# EAGLE schematic CyDAQ_schematic (EAGLE 9.0.1)
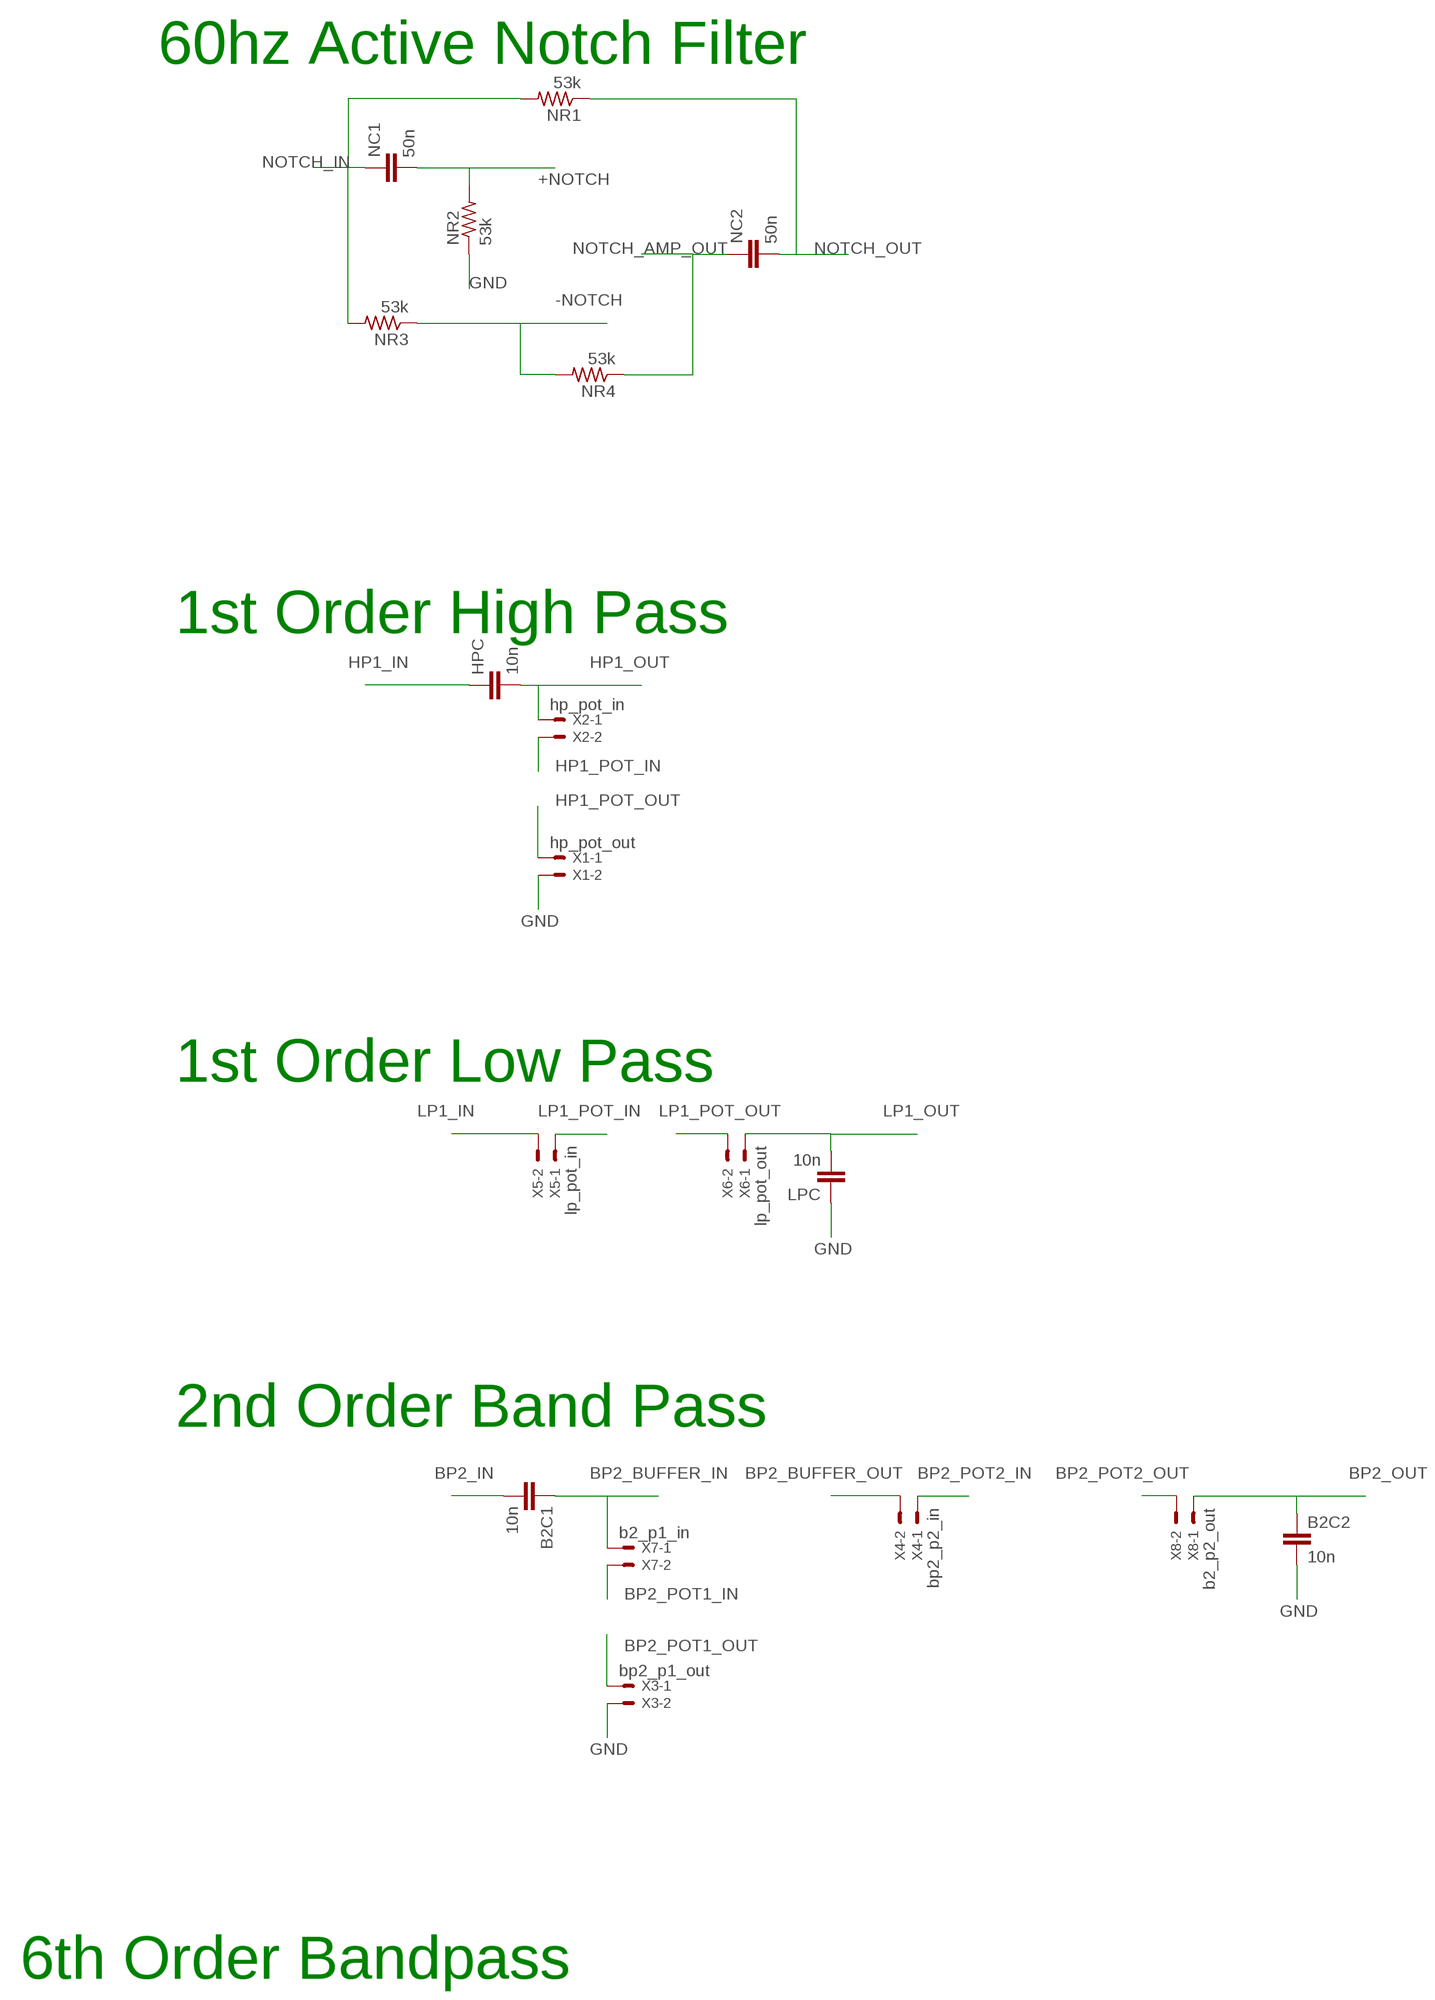
[diagram p0: schematic, sheet 1, part 1 of 3]
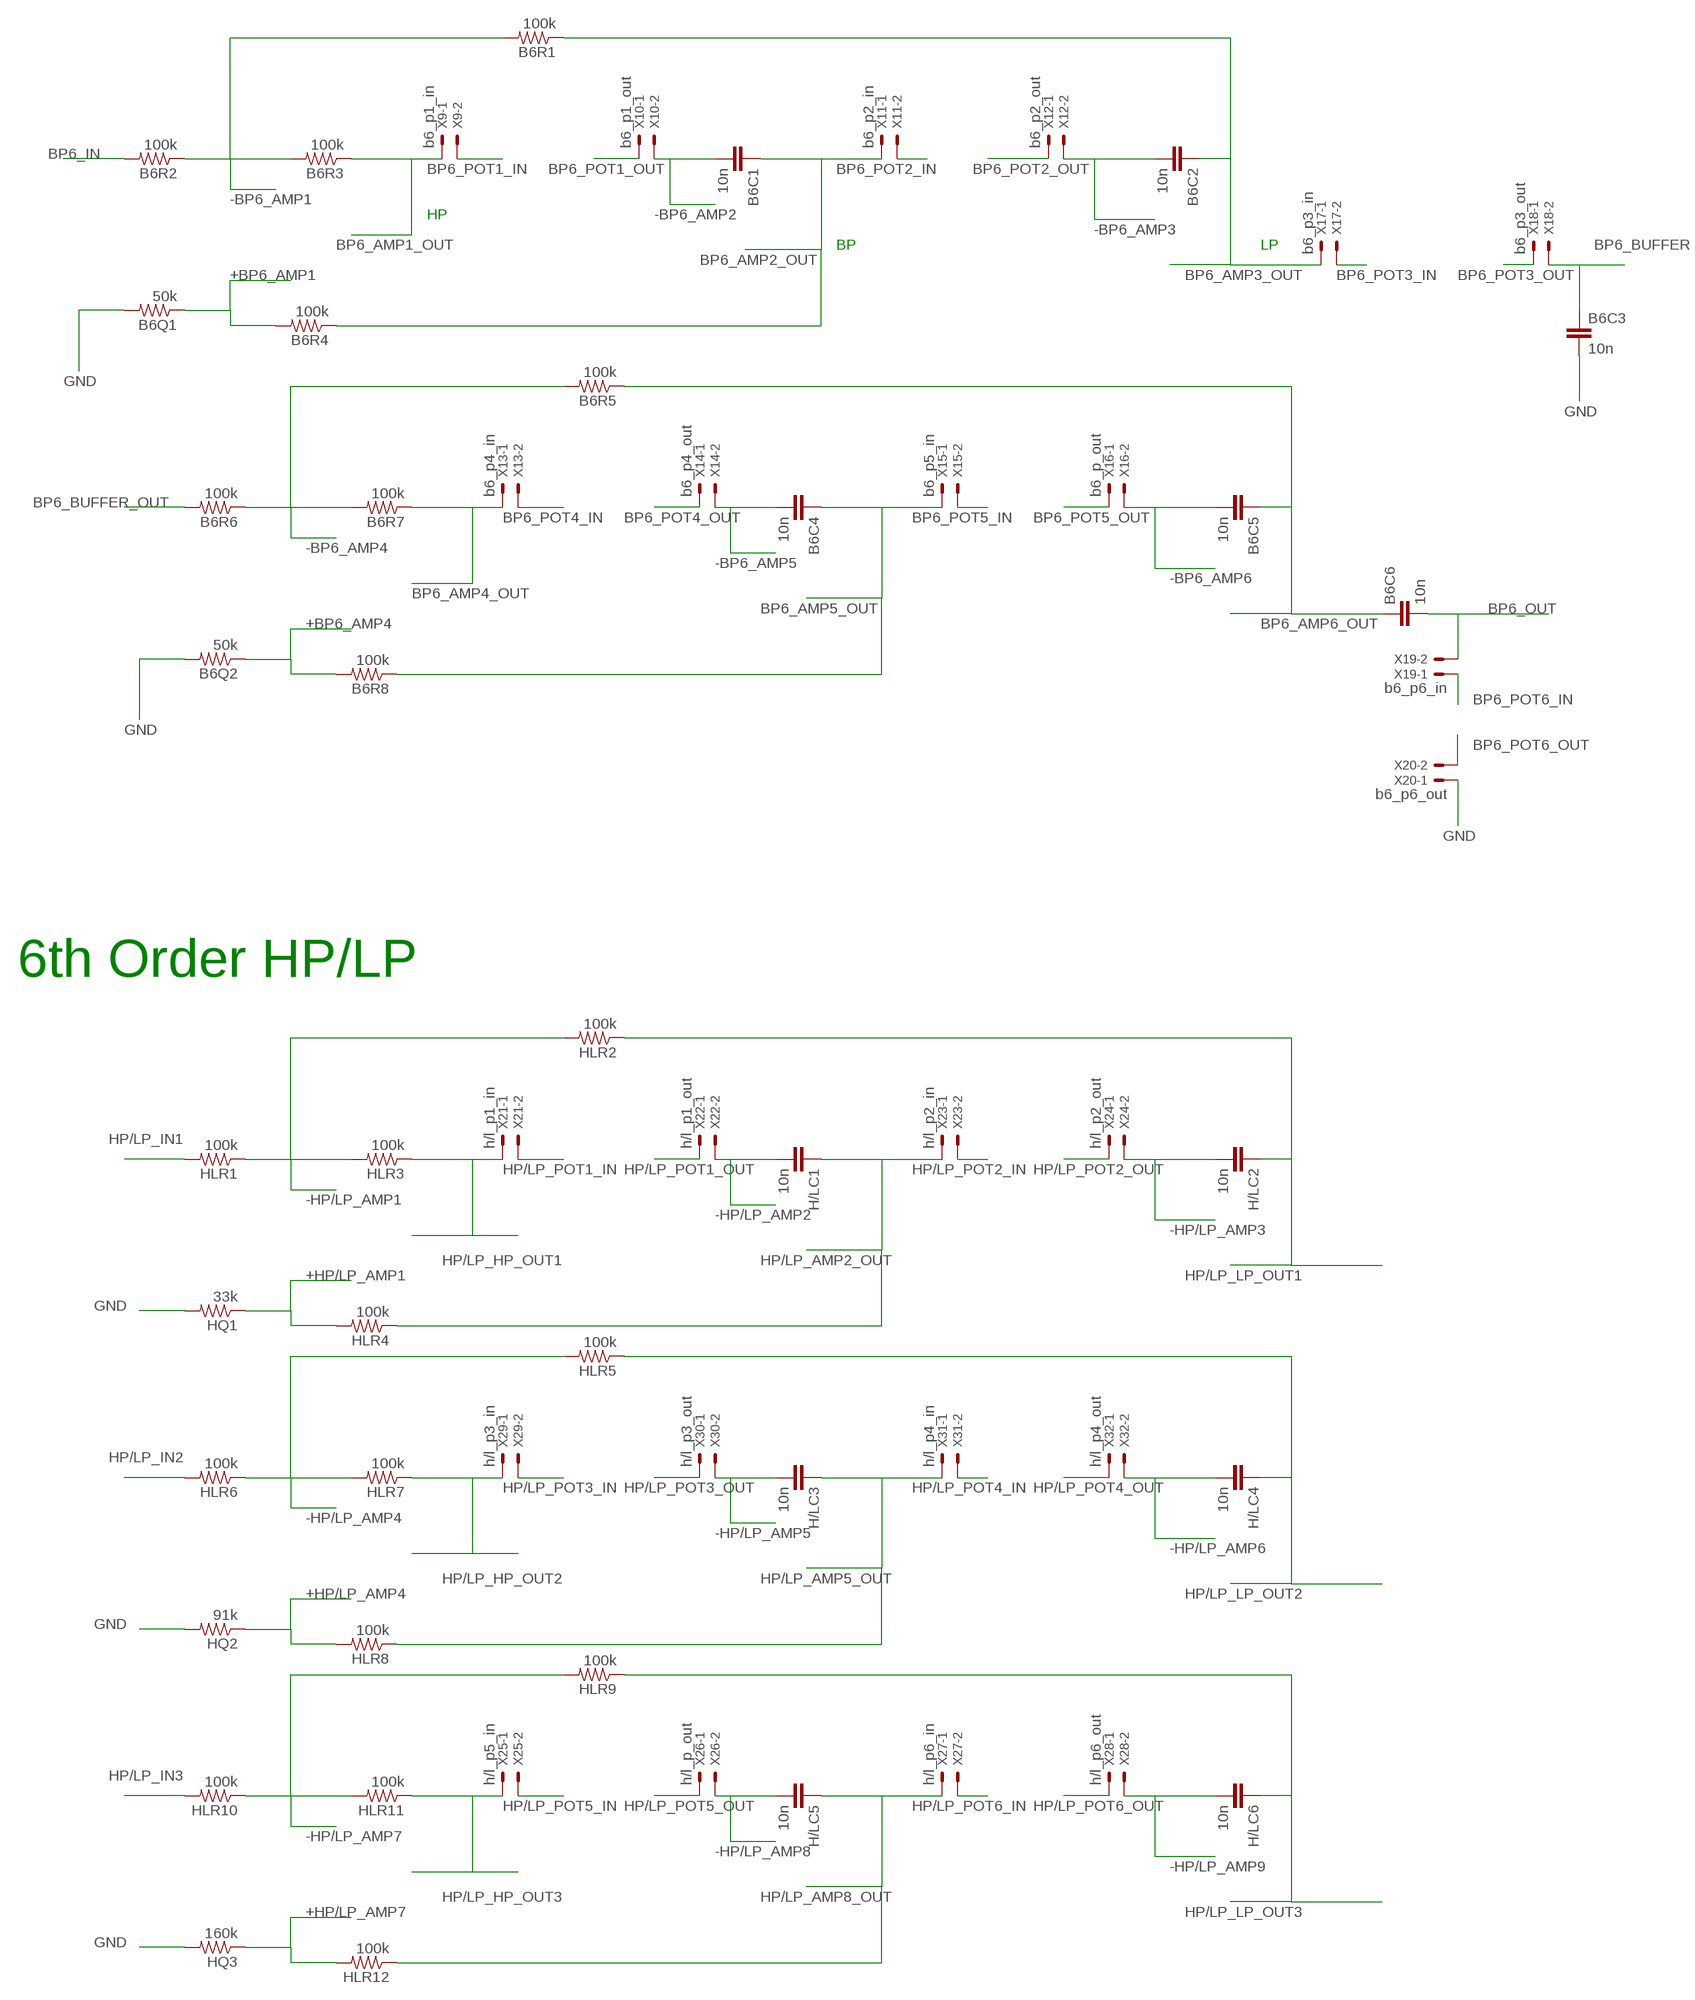
[diagram p1: schematic, sheet 1, part 2 of 3]
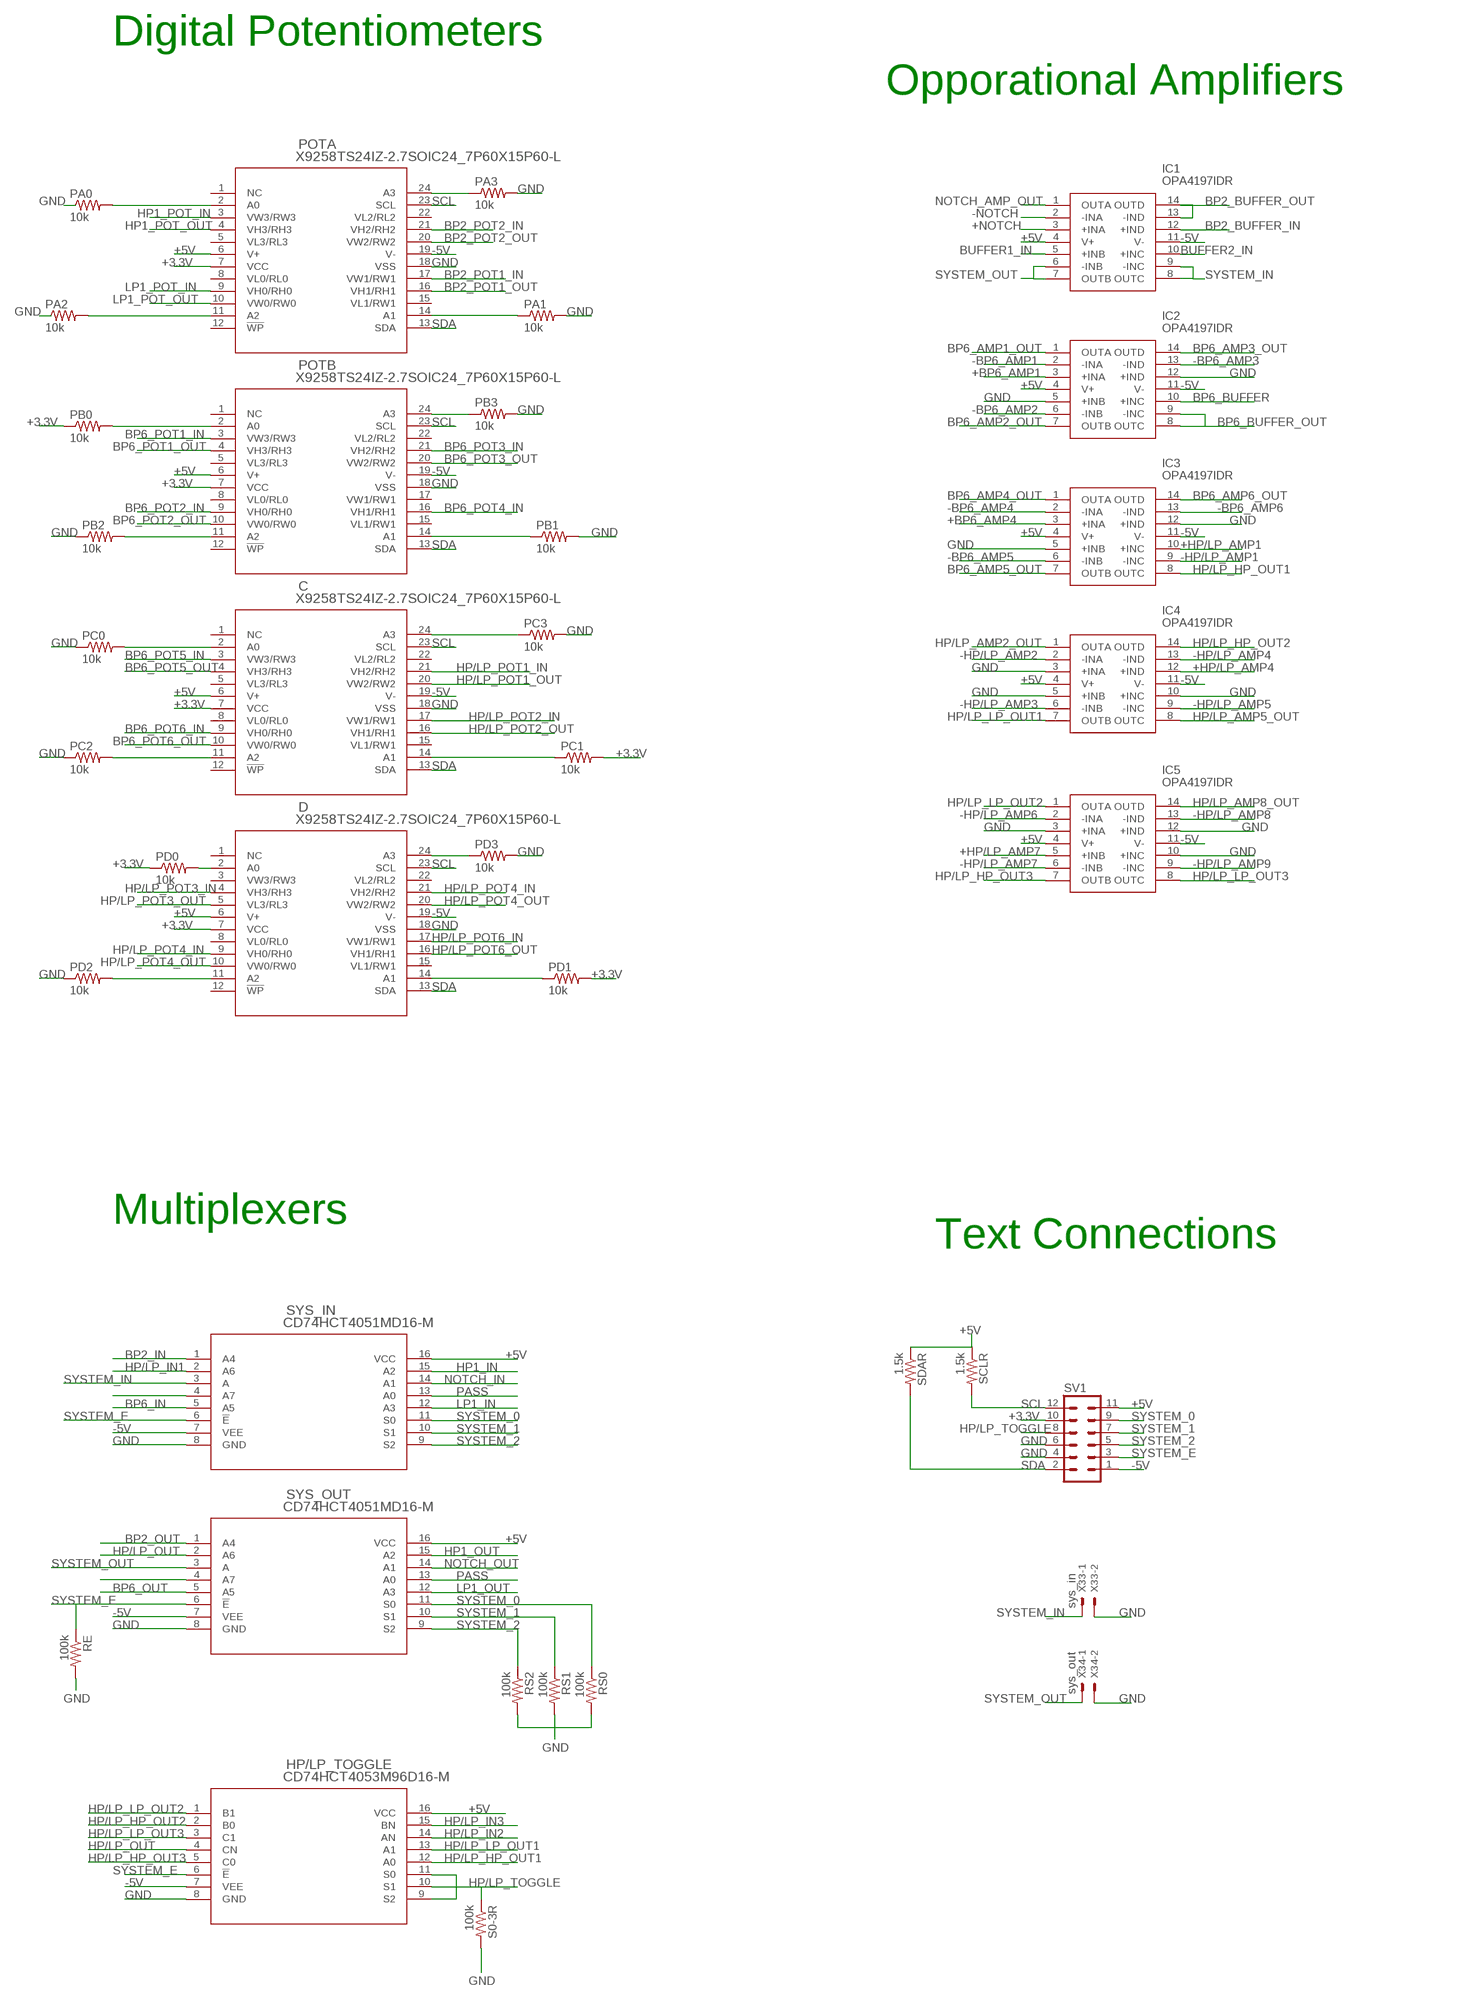
[diagram p2: schematic, sheet 1, part 3 of 3]

## Parts
B2C1  10n  C-EUC0805K  [C0805K]
B2C2  10n  C-EUC0805K  [C0805K]
B6C1  10n  C-EUC0805K  [C0805K]
B6C2  10n  C-EUC0805K  [C0805K]
B6C3  10n  C-EUC0805K  [C0805K]
B6C4  10n  C-EUC0805K  [C0805K]
B6C5  10n  C-EUC0805K  [C0805K]
B6C6  10n  C-EUC0805K  [C0805K]
B6Q1  50k  R-US_R0805W  [R0805W]
B6Q2  50k  R-US_R0805W  [R0805W]
B6R1  100k  R-US_R0805W  [R0805W]
B6R2  100k  R-US_R0805W  [R0805W]
B6R3  100k  R-US_R0805W  [R0805W]
B6R4  100k  R-US_R0805W  [R0805W]
B6R5  100k  R-US_R0805W  [R0805W]
B6R6  100k  R-US_R0805W  [R0805W]
B6R7  100k  R-US_R0805W  [R0805W]
B6R8  100k  R-US_R0805W  [R0805W]
C  X9258TS24IZ-2.7SOIC24_7P60X15P60-L  [SOIC24_7P60X15P60-L]
D  X9258TS24IZ-2.7SOIC24_7P60X15P60-L  [SOIC24_7P60X15P60-L]
H/LC1  10n  C-EUC0805K  [C0805K]
H/LC2  10n  C-EUC0805K  [C0805K]
H/LC3  10n  C-EUC0805K  [C0805K]
H/LC4  10n  C-EUC0805K  [C0805K]
H/LC5  10n  C-EUC0805K  [C0805K]
H/LC6  10n  C-EUC0805K  [C0805K]
HLR1  100k  R-US_R0805W  [R0805W]
HLR2  100k  R-US_R0805W  [R0805W]
HLR3  100k  R-US_R0805W  [R0805W]
HLR4  100k  R-US_R0805W  [R0805W]
HLR5  100k  R-US_R0805W  [R0805W]
HLR6  100k  R-US_R0805W  [R0805W]
HLR7  100k  R-US_R0805W  [R0805W]
HLR8  100k  R-US_R0805W  [R0805W]
HLR9  100k  R-US_R0805W  [R0805W]
HLR10  100k  R-US_R0805W  [R0805W]
HLR11  100k  R-US_R0805W  [R0805W]
HLR12  100k  R-US_R0805W  [R0805W]
HP/LP_TOGGLE  CD74HCT4053M96D16-M  [D16-M]
HPC  10n  C-EUC0805K  [C0805K]
HQ1  33k  R-US_R0805W  [R0805W]
HQ2  91k  R-US_R0805W  [R0805W]
HQ3  160k  R-US_R0805W  [R0805W]
IC1  OPA4197IDR  [SOIC127P600X175-14N]
IC2  OPA4197IDR  [SOIC127P600X175-14N]
IC3  OPA4197IDR  [SOIC127P600X175-14N]
IC4  OPA4197IDR  [SOIC127P600X175-14N]
IC5  OPA4197IDR  [SOIC127P600X175-14N]
LPC  10n  C-EUC0805K  [C0805K]
NC1  50n  C-EUC0805K  [C0805K]
NC2  50n  C-EUC0805K  [C0805K]
NR1  53k  R-US_R0805W  [R0805W]
NR2  53k  R-US_R0805W  [R0805W]
NR3  53k  R-US_R0805W  [R0805W]
NR4  53k  R-US_R0805W  [R0805W]
PA0  10k  R-US_R0805W  [R0805W]
PA1  10k  R-US_R0805W  [R0805W]
PA2  10k  R-US_R0805W  [R0805W]
PA3  10k  R-US_R0805W  [R0805W]
PB0  10k  R-US_R0805W  [R0805W]
PB1  10k  R-US_R0805W  [R0805W]
PB2  10k  R-US_R0805W  [R0805W]
PB3  10k  R-US_R0805W  [R0805W]
PC0  10k  R-US_R0805W  [R0805W]
PC1  10k  R-US_R0805W  [R0805W]
PC2  10k  R-US_R0805W  [R0805W]
PC3  10k  R-US_R0805W  [R0805W]
PD0  10k  R-US_R0805W  [R0805W]
PD1  10k  R-US_R0805W  [R0805W]
PD2  10k  R-US_R0805W  [R0805W]
PD3  10k  R-US_R0805W  [R0805W]
POTA  X9258TS24IZ-2.7SOIC24_7P60X15P60-L  [SOIC24_7P60X15P60-L]
POTB  X9258TS24IZ-2.7SOIC24_7P60X15P60-L  [SOIC24_7P60X15P60-L]
RE  100k  R-US_R0805W  [R0805W]
RS0  100k  R-US_R0805W  [R0805W]
RS1  100k  R-US_R0805W  [R0805W]
RS2  100k  R-US_R0805W  [R0805W]
S0-3R  100k  R-US_R0805W  [R0805W]
SCLR  1.5k  R-US_R0805W  [R0805W]
SDAR  1.5k  R-US_R0805W  [R0805W]
SV1  MA06-2  [MA06-2]
SYS_IN  CD74HCT4051MD16-M  [D16-M]
SYS_OUT  CD74HCT4051MD16-M  [D16-M]
X1  hp_pot_out  22-23-2021  [22-23-2021]
X2  hp_pot_in  22-23-2021  [22-23-2021]
X3  bp2_p1_out  22-23-2021  [22-23-2021]
X4  bp2_p2_in  22-23-2021  [22-23-2021]
X5  lp_pot_in  22-23-2021  [22-23-2021]
X6  lp_pot_out  22-23-2021  [22-23-2021]
X7  b2_p1_in  22-23-2021  [22-23-2021]
X8  b2_p2_out  22-23-2021  [22-23-2021]
X9  b6_p1_in  22-23-2021  [22-23-2021]
X10  b6_p1_out  22-23-2021  [22-23-2021]
X11  b6_p2_in  22-23-2021  [22-23-2021]
X12  b6_p2_out  22-23-2021  [22-23-2021]
X13  b6_p4_in  22-23-2021  [22-23-2021]
X14  b6_p4_out  22-23-2021  [22-23-2021]
X15  b6_p5_in  22-23-2021  [22-23-2021]
X16  b6_p_out  22-23-2021  [22-23-2021]
X17  b6_p3_in  22-23-2021  [22-23-2021]
X18  b6_p3_out  22-23-2021  [22-23-2021]
X19  b6_p6_in  22-23-2021  [22-23-2021]
X20  b6_p6_out  22-23-2021  [22-23-2021]
X21  h/l_p1_in  22-23-2021  [22-23-2021]
X22  h/l_p1_out  22-23-2021  [22-23-2021]
X23  h/l_p2_in  22-23-2021  [22-23-2021]
X24  h/l_p2_out  22-23-2021  [22-23-2021]
X25  h/l_p5_in  22-23-2021  [22-23-2021]
X26  h/l_p_out  22-23-2021  [22-23-2021]
X27  h/l_p6_in  22-23-2021  [22-23-2021]
X28  h/l_p6_out  22-23-2021  [22-23-2021]
X29  h/l_p3_in  22-23-2021  [22-23-2021]
X30  h/l_p3_out  22-23-2021  [22-23-2021]
X31  h/l_p4_in  22-23-2021  [22-23-2021]
X32  h/l_p4_out  22-23-2021  [22-23-2021]
X33  sys_in  22-23-2021  [22-23-2021]
X34  sys_out  22-23-2021  [22-23-2021]

## Nets
+3.3V: C.7(VCC) D.7(VCC) PB0.1 PC1.2 PD0.1 PD1.2 POTA.7(VCC) POTB.7(VCC) SV1.10
+5V: C.6(V+) D.6(V+) HP/LP_TOGGLE.16(VCC) IC1.4(V+) IC2.4(V+) IC3.4(V+) IC4.4(V+) IC5.4(V+) POTA.6(V+) POTB.6(V+) SCLR.1 SDAR.1 SV1.11 SYS_IN.16(VCC) SYS_OUT.16(VCC)
+BP6_AMP1: B6Q1.1 B6R4.2 IC2.3(+INA)
+BP6_AMP4: B6Q2.1 B6R8.2 IC3.3(+INA)
+HP/LP_AMP1: HLR4.2 HQ1.1 IC3.10(+INC)
+HP/LP_AMP4: HLR8.2 HQ2.1 IC4.12(+IND)
+HP/LP_AMP7: HLR12.2 HQ3.1 IC5.5(+INB)
+NOTCH: IC1.3(+INA) NC1.2 NR2.2
-5V: C.19(V-) D.19(V-) HP/LP_TOGGLE.7(VEE) IC1.11(V-) IC2.11(V-) IC3.11(V-) IC4.11(V-) IC5.11(V-) POTA.19(V-) POTB.19(V-) SV1.1 SYS_IN.7(VEE) SYS_OUT.7(VEE)
-BP6_AMP1: B6R1.2 B6R2.1 B6R3.2 IC2.2(-INA)
-BP6_AMP2: B6C1.2 IC2.6(-INB) X10.2
-BP6_AMP3: B6C2.2 IC2.13(-IND) X12.2
-BP6_AMP4: B6R5.2 B6R6.1 B6R7.2 IC3.2(-INA)
-BP6_AMP5: B6C4.2 IC3.6(-INB) X14.2
-BP6_AMP6: B6C5.2 IC3.13(-IND) X16.2
-HP/LP_AMP1: HLR1.1 HLR2.2 HLR3.2 IC3.9(-INC)
-HP/LP_AMP2: H/LC1.2 IC4.2(-INA) X22.2
-HP/LP_AMP3: H/LC2.2 IC4.6(-INB) X24.2
-HP/LP_AMP4: HLR5.2 HLR6.1 HLR7.2 IC4.13(-IND)
-HP/LP_AMP5: H/LC3.2 IC4.9(-INC) X30.2
-HP/LP_AMP6: H/LC4.2 IC5.2(-INA) X32.2
-HP/LP_AMP7: HLR9.2 HLR10.1 HLR11.2 IC5.6(-INB)
-HP/LP_AMP8: H/LC5.2 IC5.13(-IND) X26.2
-HP/LP_AMP9: H/LC6.2 IC5.9(-INC) X28.2
-NOTCH: IC1.2(-INA) NR3.1 NR4.2
BP2_BUFFER_IN: B2C1.1 IC1.12(+IND) X7.1
BP2_BUFFER_OUT: IC1.13(-IND) IC1.14(OUTD) X4.2
BP2_IN: B2C1.2 SYS_IN.1(A4)
BP2_OUT: B2C2.1 SYS_OUT.1(A4) X8.1
BP2_POT1_IN: POTA.17(VW1/RW1) X7.2
BP2_POT1_OUT: POTA.16(VH1/RH1) X3.1
BP2_POT2_IN: POTA.21(VH2/RH2) X4.1
BP2_POT2_OUT: POTA.20(VW2/RW2) X8.2
BP6_AMP1_OUT: B6R3.1 IC2.1(OUTA) X9.1
BP6_AMP2_OUT: B6C1.1 B6R4.1 IC2.7(OUTB) X11.1
BP6_AMP3_OUT: B6C2.1 B6R1.1 IC2.14(OUTD) X17.1
BP6_AMP4_OUT: B6R7.1 IC3.1(OUTA) X13.1
BP6_AMP5_OUT: B6C4.1 B6R8.1 IC3.7(OUTB) X15.1
BP6_AMP6_OUT: B6C5.1 B6C6.1 B6R5.1 IC3.14(OUTD)
BP6_BUFFER: B6C3.1 IC2.10(+INC) X18.2
BP6_BUFFER_OUT: B6R6.2 IC2.8(OUTC) IC2.9(-INC)
BP6_IN: B6R2.2 SYS_IN.5(A5)
BP6_OUT: B6C6.2 SYS_OUT.5(A5) X19.2
BP6_POT1_IN: POTB.3(VW3/RW3) X9.2
BP6_POT1_OUT: POTB.4(VH3/RH3) X10.1
BP6_POT2_IN: POTB.9(VH0/RH0) X11.2
BP6_POT2_OUT: POTB.10(VW0/RW0) X12.1
BP6_POT3_IN: POTB.21(VH2/RH2) X17.2
BP6_POT3_OUT: POTB.20(VW2/RW2) X18.1
BP6_POT4_IN: POTB.16(VH1/RH1) X13.2
BP6_POT4_OUT: X14.1
BP6_POT5_IN: C.3(VW3/RW3) X15.2
BP6_POT5_OUT: C.4(VH3/RH3) X16.1
BP6_POT6_IN: C.9(VH0/RH0) X19.1
BP6_POT6_OUT: C.10(VW0/RW0) X20.2
BUFFER1_IN: IC1.5(+INB)
BUFFER2_IN: IC1.10(+INC)
GND: B2C2.2 B6C3.2 B6Q1.2 B6Q2.2 C.18(VSS) D.18(VSS) HP/LP_TOGGLE.8(GND) HQ1.2 HQ2.2 HQ3.2 IC2.5(+INB) IC2.12(+IND) IC3.5(+INB) IC3.12(+IND) IC4.3(+INA) IC4.5(+INB) IC4.10(+INC) IC5.3(+INA) IC5.10(+INC) IC5.12(+IND) LPC.1 NR2.1 PA0.1 PA1.2 PA2.1 PA3.2 PB1.2 PB2.1 PB3.2 PC0.1 PC2.1 PC3.2 PD2.1 PD3.2 POTA.18(VSS) POTB.18(VSS) RE.2 RS0.2 RS1.2 RS2.2 S0-3R.2 SV1.4 SV1.6 SYS_IN.8(GND) SYS_OUT.8(GND) X1.2 X3.2 X20.1 X33.2 X34.2
HP1_IN: HPC.1 SYS_IN.15(A2)
HP1_OUT: HPC.2 SYS_OUT.15(A2) X2.1
HP1_POT_IN: POTA.3(VW3/RW3) X2.2
HP1_POT_OUT: POTA.4(VH3/RH3) X1.1
HP/LP_AMP2_OUT: H/LC1.1 HLR4.1 IC4.1(OUTA) X23.1
HP/LP_AMP5_OUT: H/LC3.1 HLR8.1 IC4.8(OUTC) X31.1
HP/LP_AMP8_OUT: H/LC5.1 HLR12.1 IC5.14(OUTD) X27.1
HP/LP_HP_OUT1: HLR3.1 HP/LP_TOGGLE.12(A0) IC3.8(OUTC) X21.1
HP/LP_HP_OUT2: HLR7.1 HP/LP_TOGGLE.2(B0) IC4.14(OUTD) X29.1
HP/LP_HP_OUT3: HLR11.1 HP/LP_TOGGLE.5(C0) IC5.7(OUTB) X25.1
HP/LP_IN1: HLR1.2 SYS_IN.2(A6)
HP/LP_IN2: HLR6.2 HP/LP_TOGGLE.14(AN)
HP/LP_IN3: HLR10.2 HP/LP_TOGGLE.15(BN)
HP/LP_LP_OUT1: H/LC2.1 HLR2.1 HP/LP_TOGGLE.13(A1) IC4.7(OUTB)
HP/LP_LP_OUT2: H/LC4.1 HLR5.1 HP/LP_TOGGLE.1(B1) IC5.1(OUTA)
HP/LP_LP_OUT3: H/LC6.1 HLR9.1 HP/LP_TOGGLE.3(C1) IC5.8(OUTC)
HP/LP_OUT: HP/LP_TOGGLE.4(CN) SYS_OUT.2(A6)
HP/LP_POT1_IN: C.21(VH2/RH2) X21.2
HP/LP_POT1_OUT: C.20(VW2/RW2) X22.1
HP/LP_POT2_IN: C.17(VW1/RW1) X23.2
HP/LP_POT2_OUT: C.16(VH1/RH1) X24.1
HP/LP_POT3_IN: D.4(VH3/RH3) X29.2
HP/LP_POT3_OUT: D.5(VL3/RL3) X30.1
HP/LP_POT4_IN: D.9(VH0/RH0) D.21(VH2/RH2) X31.2
HP/LP_POT4_OUT: D.10(VW0/RW0) D.20(VW2/RW2) X32.1
HP/LP_POT5_IN: X25.2
HP/LP_POT5_OUT: X26.1
HP/LP_POT6_IN: D.17(VW1/RW1) X27.2
HP/LP_POT6_OUT: D.16(VH1/RH1) X28.1
HP/LP_TOGGLE: HP/LP_TOGGLE.9(S2) HP/LP_TOGGLE.10(S1) HP/LP_TOGGLE.11(S0) S0-3R.1 SV1.8
LP1_IN: SYS_IN.12(A3) X5.2
LP1_OUT: LPC.2 SYS_OUT.12(A3) X6.1
LP1_POT_IN: POTA.9(VH0/RH0) X5.1
LP1_POT_OUT: POTA.10(VW0/RW0) X6.2
N$1: PA0.2 POTA.2(A0)
N$2: PA2.2 POTA.11(A2)
N$3: PA1.1 POTA.14(A1)
N$4: PA3.1 POTA.24(A3)
N$5: PB0.2 POTB.2(A0)
N$6: PB2.2 POTB.11(A2)
N$7: PB1.1 POTB.14(A1)
N$8: PB3.1 POTB.24(A3)
N$10: C.2(A0) PC0.2
N$11: C.11(A2) PC2.2
N$12: C.14(A1) PC1.1
N$13: C.24(A3) PC3.1
N$14: D.2(A0) PD0.2
N$15: D.11(A2) PD2.2
N$16: D.14(A1) PD1.1
N$17: D.24(A3) PD3.1
N$26: SYS_OUT.4(A7)
N$36: SYS_IN.4(A7)
NOTCH_AMP_OUT: IC1.1(OUTA) NC2.1 NR4.1
NOTCH_IN: NC1.1 NR1.2 NR3.2 SYS_IN.14(A1)
NOTCH_OUT: NC2.2 NR1.1 SYS_OUT.14(A1)
PASS: SYS_IN.13(A0) SYS_OUT.13(A0)
SCL: C.23(SCL) D.23(SCL) POTA.23(SCL) POTB.23(SCL) SCLR.2 SV1.12
SDA: C.13(SDA) D.13(SDA) POTA.13(SDA) POTB.13(SDA) SDAR.2 SV1.2
SYSTEM_0: RS0.1 SV1.9 SYS_IN.11(S0) SYS_OUT.11(S0)
SYSTEM_1: RS1.1 SV1.7 SYS_IN.10(S1) SYS_OUT.10(S1)
SYSTEM_2: RS2.1 SV1.5 SYS_IN.9(S2) SYS_OUT.9(S2)
SYSTEM_E: HP/LP_TOGGLE.6(!E) RE.1 SV1.3 SYS_IN.6(!E) SYS_OUT.6(!E)
SYSTEM_IN: IC1.8(OUTC) IC1.9(-INC) SYS_IN.3(A) X33.1
SYSTEM_OUT: IC1.6(-INB) IC1.7(OUTB) SYS_OUT.3(A) X34.1
Unconnected: C.1(NC) C.5(VL3/RL3) C.8(VL0/RL0) C.12(!WP) C.15(VL1/RW1) C.22(VL2/RL2) D.1(NC) D.3(VW3/RW3) D.8(VL0/RL0) D.12(!WP) D.15(VL1/RW1) D.22(VL2/RL2) POTA.1(NC) POTA.5(VL3/RL3) POTA.8(VL0/RL0) POTA.12(!WP) POTA.15(VL1/RW1) POTA.22(VL2/RL2) POTB.1(NC) POTB.5(VL3/RL3) POTB.8(VL0/RL0) POTB.12(!WP) POTB.15(VL1/RW1) POTB.17(VW1/RW1) POTB.22(VL2/RL2)

## Notes on the sheet
- 60hz Active Notch Filter
- 1st Order High Pass
- Digital Potentiometers
- Opporational Amplifiers
- 1st Order Low Pass
- 2nd Order Band Pass
- 6th Order Bandpass
- HP
- BP | LP
- Multiplexers
- Text Connections
- 6th Order HP/LP

## Library data of the parts
B2C1 B2C2 B6C1-B6C6 H/LC1-H/LC6 HPC LPC NC1 NC2 = resistor:C-EU: CAPACITOR, European symbol
B6Q1 B6Q2 B6R1-B6R8 HLR1-HLR12 HQ1-HQ3 NR1-NR4 PA0 PA1-PA3 PB0 PB1-PB3 PC0 PC1-PC3 PD0 PD1-PD3 RE RS0 RS1 RS2 S0-3R SCLR SDAR = resistor:R-US_: RESISTOR, American symbol
C D POTA POTB = potWithPosNeg5:X9258TS24IZ-2.7; MANUFACTURER_PART_NUMBER: X9258TS24IZ2.7; VENDOR: Intersil
HP/LP_TOGGLE = 3, 2 to 1 muxes:CD74HCT4053M96; MANUFACTURER_PART_NUMBER: CD74HCT4053M96; VENDOR: Texas Instruments
IC1-IC5 = opAmp:OPA4197IDR: 36-V, Precision, Rail-to-Rail Input Output, Low Offset Voltage Op Amp Source: Datasheet <http://www.ti.com/lit/gpn/opa4197>; DESCRIPTION: 36-V, Precision, Rail-to-Rail Input Output, Low Offset Voltage Op Amp; HEIGHT: 1.75mm; MANUFACTURER_NAME: Texas Instruments; MANUFACTURER_PART_NUMBER: OPA4197IDR; MOUSER_PART_NUMBER: 595-OPA4197IDR
SV1 = con-lstb:MA06-2: PIN HEADER; OC_FARNELL: unknown; OC_NEWARK: unknown
SYS_IN SYS_OUT = 8 to one mux:CD74HCT4051M; MANUFACTURER_PART_NUMBER: CD74HCT4051M; VENDOR: Texas Instruments
X1-X34 = con-molex:22-23-2021: .100" (2.54mm) Center Header - 2 Pin; MF: MOLEX; MPN: 22-23-2021; OC_FARNELL: 1462926; OC_NEWARK: 25C3832